# Altium schematic sheet IO.SchDoc
size A4
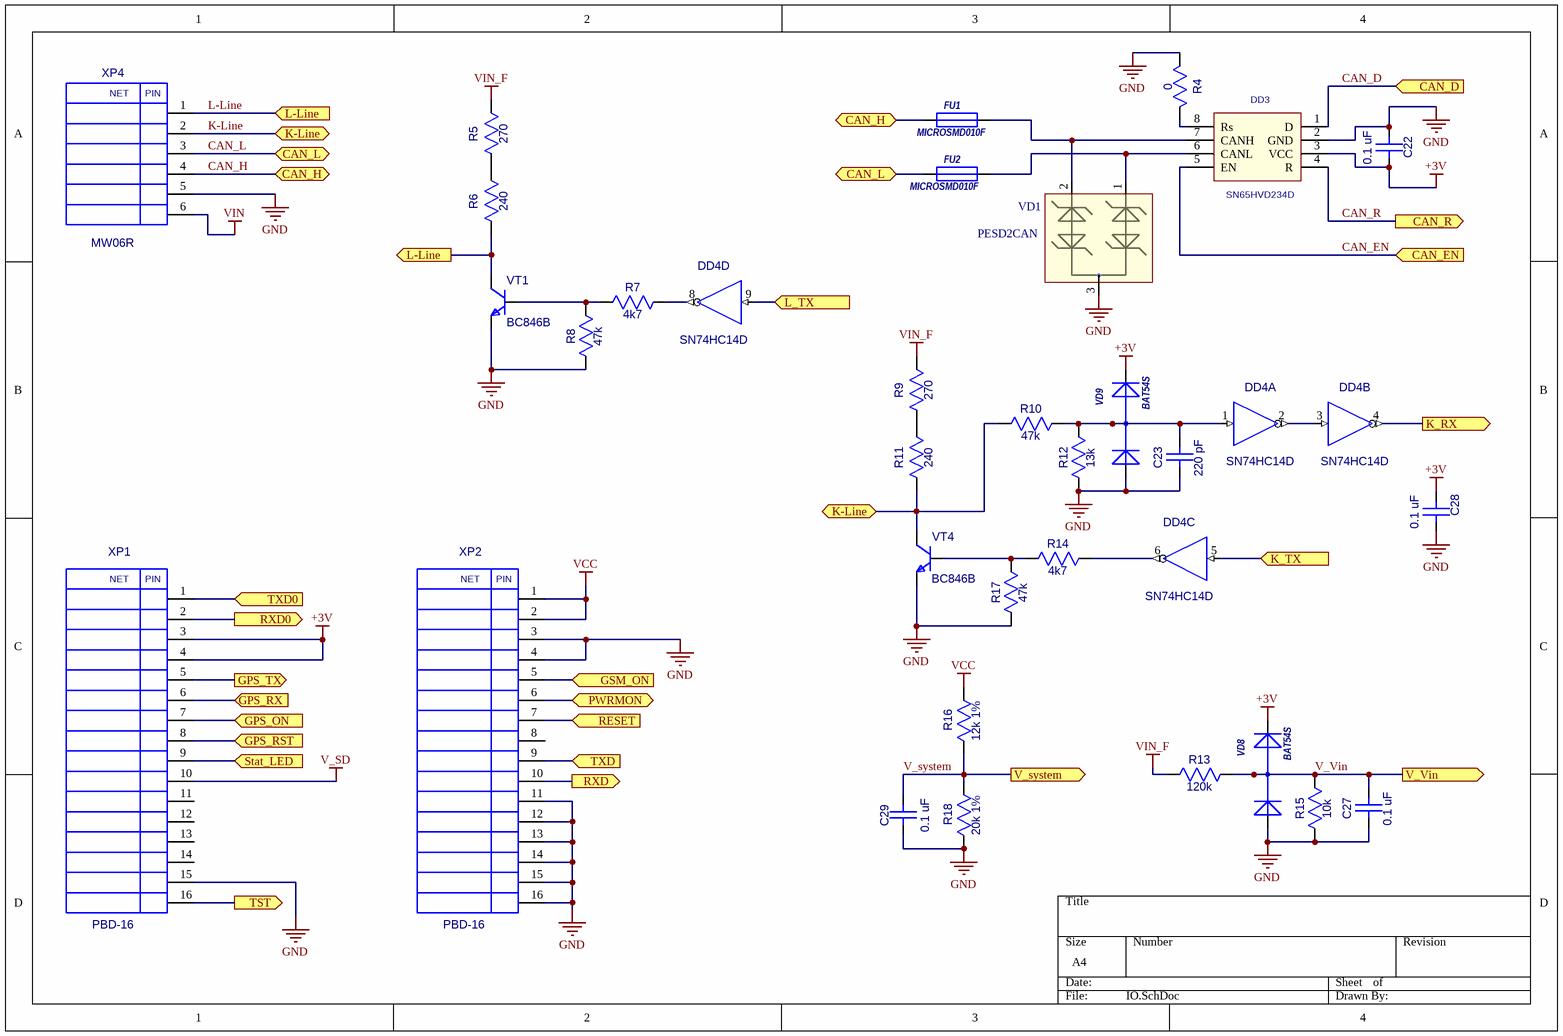
[diagram p0: IO.SchDoc]

## Parts
C22  0.1 uF  [CC0603-3M]
C23  220 pF  [CC0603-3M]
C27  0.1 uF  [CC0603-3M]
C28  0.1 uF  [CC0603-3M]
C29  0.1 uF  [CC0603-3M]
DD3  SN65HVD234D  [SO-8]
DD4  SN74HC14D  [SO14]  (parts A,B,C,D of 6)
FU1  MICROSMD010F  [RC1210]
FU2  MICROSMD010F  [RC1210]
R4  0  [RC0603-3M]
R5  270  [RC1206-2M]
R6  240  [RC1206-2M]
R7  4k7  [RC0603-3M]
R8  47k  [RC0603-3M]
R9  270  [RC1206-2M]
R10  47k  [RC0603-3M]
R11  240  [RC1206-2M]
R12  13k  [RC0603-3M]
R13  120k  [RC0603-3M]
R14  4k7  [RC0603-3M]
R15  10k  [RC0603-3M]
R16  12k 1%  [RC0603-3M]
R17  47k  [RC0603-3M]
R18  20k 1%  [RC0603-3M]
VD1  PESD2CAN  [SOT-23(123)]
VD8  BAT54S  [SOT-23(GSD)]
VD9  BAT54S  [SOT-23(GSD)]
VT1  BC846B  [SOT-23(123)]
VT4  BC846B  [SOT-23(123)]
XP1  PBD-16  [PBD16]
XP2  PBD-16  [PBD16]
XP4  MW06R  [MW06R]

## Ports
CAN_D (in), CAN_EN (in), CAN_H (bidir), CAN_L (bidir), CAN_R (out), GPS_ON (in), GPS_RST (in), GPS_RX (in), GPS_TX (out), GSM_ON (in), K-Line (bidir), K_RX (out), K_TX (in), L-Line (in), L-Line (out), L_TX (in), PWRMON, RESET (in), RXD0 (out), RXD (out), Stat_LED (in), TST (out), TXD0 (in), TXD (in), V_system (out), V_Vin (out)

## Nets
+3V: C22.1(A) C28.2(B) DD3.3(VCC) DD4.14(+5V) VD8.2(K) VD9.2(K) XP1.3 XP1.4
GND: C22.2(B) C23.2(B) C27.2(B) C28.1(A) C29.2(B) DD3.2(GND) DD4.7(GND) R4.2(B) R8.2(B) R12.2(B) R15.2(B) R17.2(B) R18.1(A) VD1.3 VD8.1(A) VD9.1(A) VT1.2(E) VT4.2(E) XP1.15 XP2.3 XP2.4 XP2.11 XP2.12 XP2.13 XP2.14 XP2.15 XP2.16 XP4.5
V_SD: XP1.10
VCC: R16.2(B) XP2.1 XP2.2
VIN: XP4.6
VIN_F: R5.2(B) R9.2(B) R13.2(B)
CAN_D: DD3.1(D) ; port CAN_D
CAN_EN: DD3.5(EN) ; port CAN_EN
CAN_H: FU1.1 XP4.4 ; port CAN_H
CAN_L: FU2.1 XP4.3 ; port CAN_L
CAN_R: DD3.4(R) ; port CAN_R
GPS_ON: XP1.7 ; port GPS_ON
GPS_RST: XP1.8 ; port GPS_RST
GPS_RX: XP1.6 ; port GPS_RX
GPS_TX: XP1.5 ; port GPS_TX
GSM_ON: XP2.5 ; port GSM_ON
K-Line: R10.2(B) R11.1(A) VT4.3(C) XP4.2 ; port K-Line
K_RX: DD4.4(Y) ; port K_RX
K_TX: DD4.5(A) ; port K_TX
L-Line: R6.1(A) VT1.3(C) XP4.1 ; port L-Line
L_TX: DD4.9(A) ; port L_TX
PWRMON: XP2.6 ; port PWRMON
RESET: XP2.7 ; port RESET
RXD: XP2.10 ; port RXD
RXD0: XP1.2 ; port RXD0
Stat_LED: XP1.9 ; port Stat_LED
TST: XP1.16 ; port TST
TXD: XP2.9 ; port TXD
TXD0: XP1.1 ; port TXD0
V_system: C29.1(A) R16.1(A) R18.2(B) ; port V_system
V_Vin: C27.1(A) R13.1(A) R15.1(A) VD8.3(AK) ; port V_Vin
NetC23_1: C23.1(A) DD4.1(A) R10.1(A) R12.1(A) VD9.3(AK)
NetDD3_6: DD3.6(CANL) FU2.2 VD1.1
NetDD3_7: DD3.7(CANH) FU1.2 VD1.2
NetDD3_8: DD3.8(Rs) R4.1(A)
NetDD4_2: DD4.2(Y) DD4.3(A)
NetDD4_6: DD4.6(Y) R14.1(A)
NetDD4_8: DD4.8(Y) R7.1(A)
NetR5_1: R5.1(A) R6.2(B)
NetR7_2: R7.2(B) R8.1(A) VT1.1(B)
NetR9_1: R9.1(A) R11.2(B)
NetR14_2: R14.2(B) R17.1(A) VT4.1(B)

Not connected (* = marked no-connect by the designer): XP1 11 12 13 14; XP2 8

## Notes on the sheet
- (in symbol MW06R) NET; PIN
- (in symbol PBD-16) NET; PIN

## Library data of the parts
C22 C23 C27-C29 = CC0603
  C22 C27-C29: Value: 0.1 uF
  C23: Value: 220 pF
DD3 = SN65HVD234D: CAN Transceiver; Value: *
DD4 = SN74HC14D: Hex Schmitt-Trigger INVERTERS; Value: *
FU1 FU2 = MICROSMD: Value: MICROSMD010F
R4 R7 R8 R10 R12-R18 = RC0603
  R4: Value: 0
  R7 R14: Value: 4k7
  R8 R10 R17: Value: 47k
  R12: Value: 13k
  R13: Value: 120k
  R15: Value: 10k
  R16: Value: 12k 1%
  R18: Value: 20k 1%
R5 R6 R9 R11 = RC1206
  R5 R9: Value: 270
  R6 R11: Value: 240
VD1 = PESD2CAN: TVS for CAN
VD8 VD9 = BAT54S: 1.0 Ampere General Purpose Rectifier; ComponentField6: Published 8-Jun-2000, Modified 11-July-2000: SIM Model Added.; Value: *
VT1 VT4 = BC846BLT1: Value: {Value}; ComponentField7: Published 29-Sep-2000; OriginalName: BC846BLT1
XP1 XP2 = PBD-16: Value: *
XP4 = MW06R: Value: *